# EAGLE design AGSE_BBB_cape (EAGLE 7.2.0)
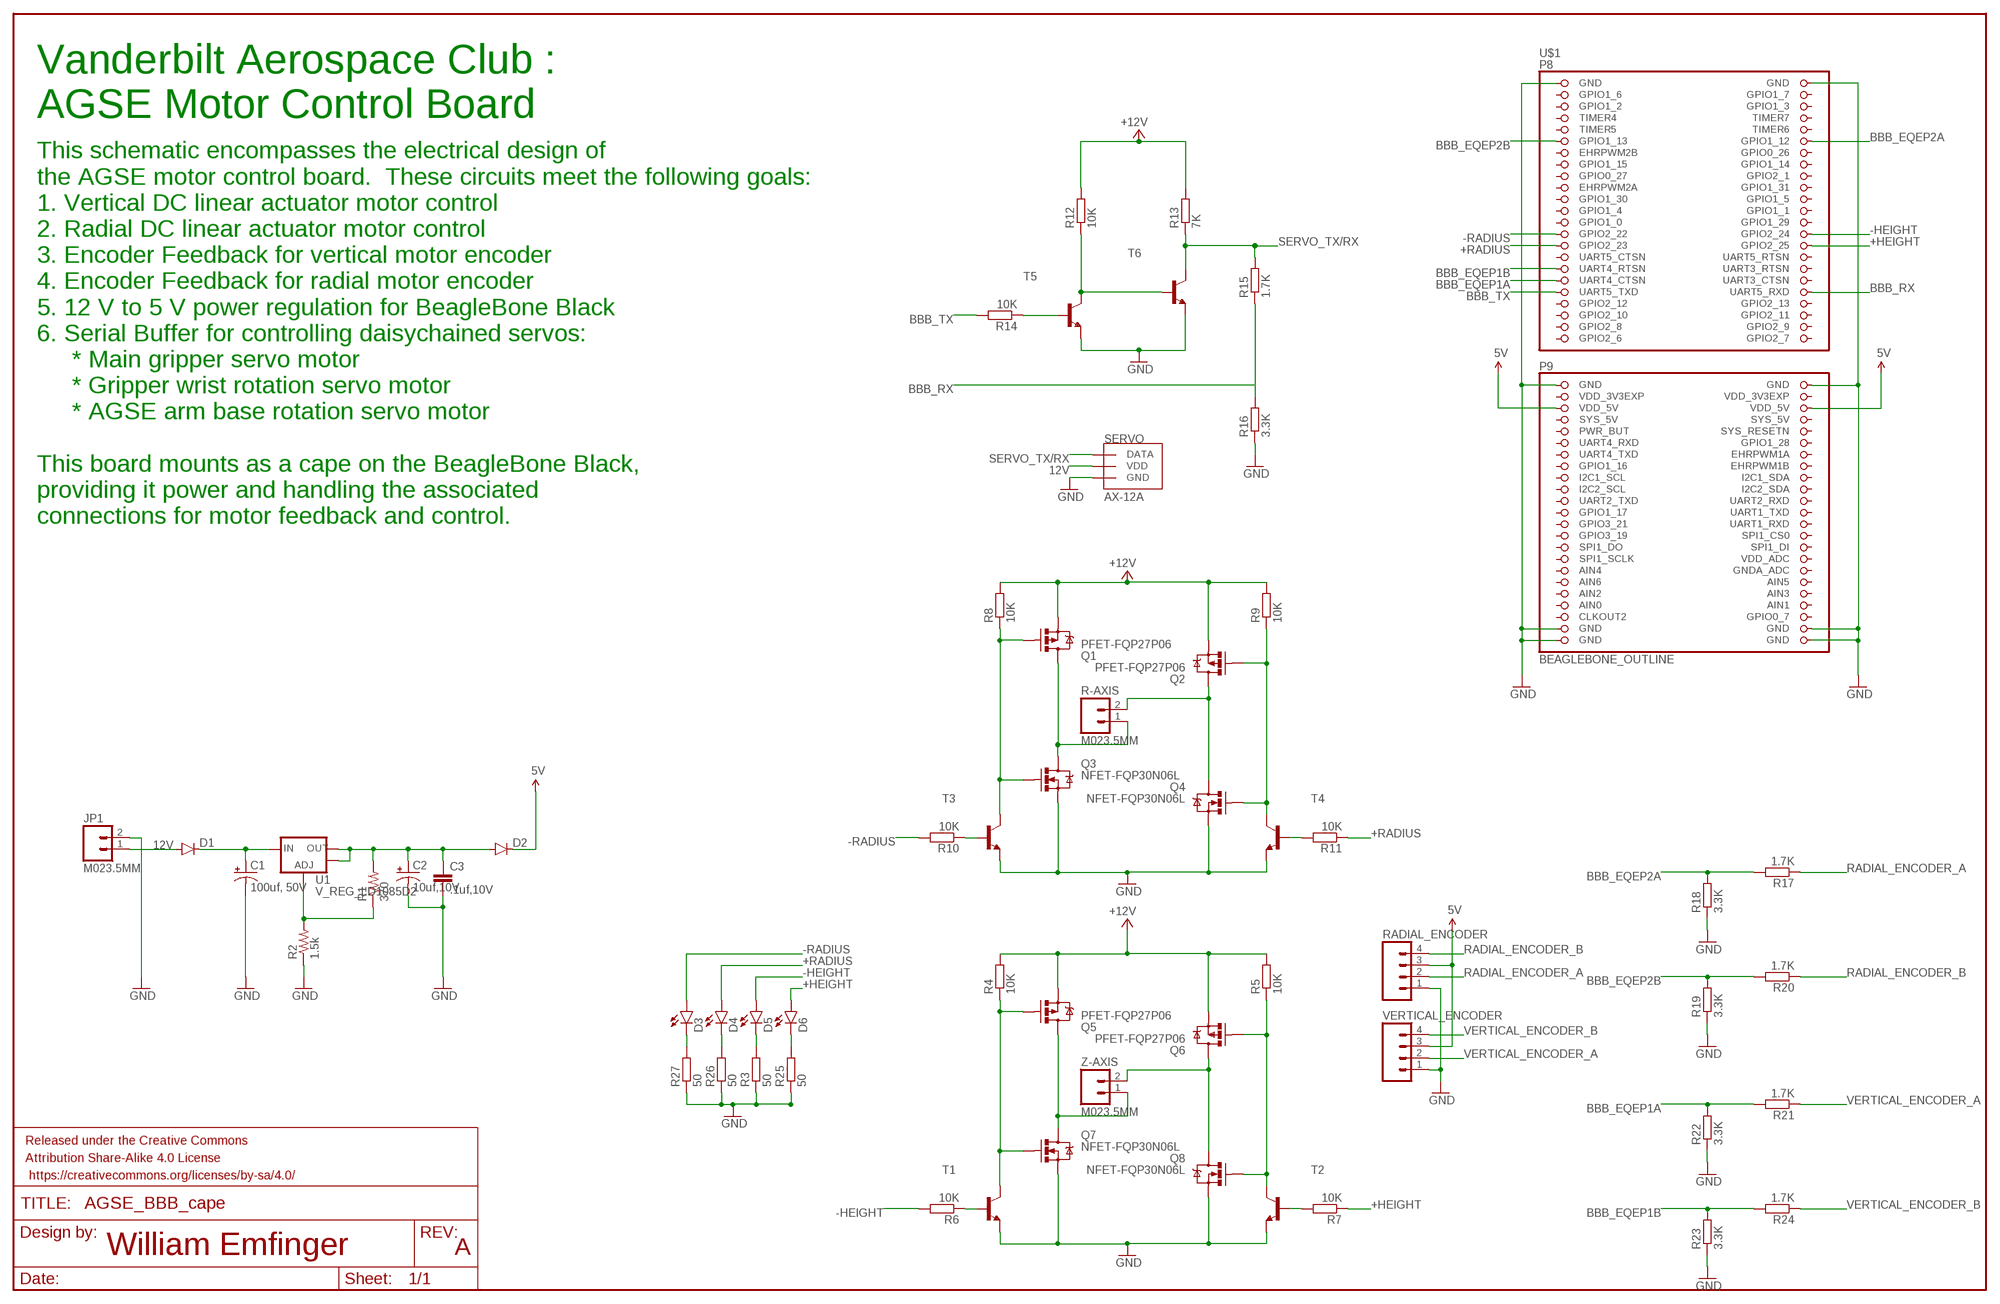
[diagram p0: schematic, sheet 1]

## Parts
C1  100uf, 50V  CAP_POLD  [PANASONIC_D]
C2  10uf,10V  CAP_POL1206  [EIA3216]
C3  .1uf,10V  CAP0402-CAP  [0402-CAP]
D1  DIODESMA  [SMA-DIODE]
D2  DIODE1N4148  [DIODE-1N4148]
D3  LED-FKIT-1206  [FKIT-LED-1206]
D4  LED-FKIT-1206  [FKIT-LED-1206]
D5  LED-FKIT-1206  [FKIT-LED-1206]
D6  LED-FKIT-1206  [FKIT-LED-1206]
FRAME1  FRAME-LEDGER  [CREATIVE_COMMONS]
JP1  M023.5MM  [SCREWTERMINAL-3.5MM-2]
Q1  PFET-FQP27P06  MOSFET-PCHANNELFQP27P06  [TO220V]
Q2  PFET-FQP27P06  MOSFET-PCHANNELFQP27P06  [TO220V]
Q3  NFET-FQP30N06L  MOSFET-NCHANNELFQP30N06L  [TO220V]
Q4  NFET-FQP30N06L  MOSFET-NCHANNELFQP30N06L  [TO220V]
Q5  PFET-FQP27P06  MOSFET-PCHANNELFQP27P06  [TO220V]
Q6  PFET-FQP27P06  MOSFET-PCHANNELFQP27P06  [TO220V]
Q7  NFET-FQP30N06L  MOSFET-NCHANNELFQP30N06L  [TO220V]
Q8  NFET-FQP30N06L  MOSFET-NCHANNELFQP30N06L  [TO220V]
R1  370  RESISTOR0402-RES  [0402-RES]
R2  1.5k  RESISTOR0402-RES  [0402-RES]
R3  50  R-EU_M0805  [M0805]
R4  10K  R-EU_M0805  [M0805]
R5  10K  R-EU_M0805  [M0805]
R6  10K  R-EU_M0805  [M0805]
R7  10K  R-EU_M0805  [M0805]
R8  10K  R-EU_M0805  [M0805]
R9  10K  R-EU_M0805  [M0805]
R10  10K  R-EU_M0805  [M0805]
R11  10K  R-EU_M0805  [M0805]
R12  10K  R-EU_M0805  [M0805]
R13  7K  R-EU_M0805  [M0805]
R14  10K  R-EU_M0805  [M0805]
R15  1.7K  R-EU_M0805  [M0805]
R16  3.3K  R-EU_M0805  [M0805]
R17  1.7K  R-EU_M0805  [M0805]
R18  3.3K  R-EU_M0805  [M0805]
R19  3.3K  R-EU_M0805  [M0805]
R20  1.7K  R-EU_M0805  [M0805]
R21  1.7K  R-EU_M0805  [M0805]
R22  3.3K  R-EU_M0805  [M0805]
R23  3.3K  R-EU_M0805  [M0805]
R24  1.7K  R-EU_M0805  [M0805]
R25  50  R-EU_M0805  [M0805]
R26  50  R-EU_M0805  [M0805]
R27  50  R-EU_M0805  [M0805]
R-AXIS  M023.5MM  [SCREWTERMINAL-3.5MM-2]
RADIAL_ENCODER  M04POLAR  [MOLEX-1X4]
SERVO  AX-12A  [SPOX-3]
T1  BF820-NPN-SOT23-BEC  [SOT23-BEC]
T2  BF820-NPN-SOT23-BEC  [SOT23-BEC]
T3  BF820-NPN-SOT23-BEC  [SOT23-BEC]
T4  BF820-NPN-SOT23-BEC  [SOT23-BEC]
T5  BF820-NPN-SOT23-BEC  [SOT23-BEC]
T6  BF820-NPN-SOT23-BEC  [SOT23-BEC]
U1  V_REG_LD1085D2  [D2PACK/A]
U$1  BEAGLEBONE_OUTLINE  [BEAGLEBONE_SHIELD]
VERTICAL_ENCODER  M04POLAR  [MOLEX-1X4]
Z-AXIS  M023.5MM  [SCREWTERMINAL-3.5MM-2]

## Nets
5V: D2.C RADIAL_ENCODER.3 U$1.51(VDD_5V) U$1.52(VDD_5V) VERTICAL_ENCODER.3
12V: D1.A JP1.1 Q1.3(S) Q2.3(S) Q5.3(S) Q6.3(S) R4.2 R5.2 R8.2 R9.2 R12.2 R13.2 SERVO.P$2(VDD) ; supply symbol labelled +12V
+HEIGHT: D6.A R7.1 U$1.30(GPIO2_25)
+RADIUS: D4.A R11.1 U$1.29(GPIO2_23)
-HEIGHT: D5.A R6.2 U$1.28(GPIO2_24)
-RADIUS: D3.A R10.2 U$1.27(GPIO2_22)
BBB_EQEP1A: R21.2 R22.2 U$1.35(UART4_CTSN)
BBB_EQEP1B: R23.2 R24.2 U$1.33(UART4_RTSN)
BBB_EQEP2A: R17.2 R18.2 U$1.12(GPIO1_12)
BBB_EQEP2B: R19.2 R20.2 U$1.11(GPIO1_13)
BBB_RX: R15.1 R16.2 U$1.38(UART5_RXD)
BBB_TX: R14.2 U$1.37(UART5_TXD)
GND: C1.- C2.C(-) C3.2 JP1.2 Q3.3(S) Q4.3(S) Q7.3(S) Q8.3(S) R2.1 R3.1 R16.1 R18.1 R19.1 R22.1 R23.1 R25.1 R26.1 R27.1 RADIAL_ENCODER.1 SERVO.P$3(GND) T1.E T2.E T3.E T4.E T5.E T6.E U$1.1(GND) U$1.2(GND) U$1.47(GND) U$1.48(GND) U$1.89(GND) U$1.90(GND) U$1.91(GND) U$1.92(GND) VERTICAL_ENCODER.1
N$1: D3.C R27.2
N$2: D4.C R26.2
N$3: C1.+ D1.C U1.3(IN)
N$4: R1.1 R2.2 U1.1(ADJ)
N$5: D5.C R3.2
N$6: D6.C R25.2
N$7: Q5.1(G) Q7.1(G) R4.1 T1.C
N$8: Q6.1(G) Q8.1(G) R5.1 T2.C
N$9: R6.1 T1.B
N$10: R7.2 T2.B
N$13: Q1.1(G) Q3.1(G) R8.1 T3.C
N$14: Q2.1(G) Q4.1(G) R9.1 T4.C
N$15: R10.1 T3.B
N$16: R11.2 T4.B
N$17: R14.1 T5.B
N$18: R12.1 T5.C T6.B
R+: Q1.2(D) Q3.2(D) R-AXIS.1
R-: Q2.2(D) Q4.2(D) R-AXIS.2
RADIAL_ENCODER_A: R17.1 RADIAL_ENCODER.2
RADIAL_ENCODER_B: R20.1 RADIAL_ENCODER.4
SERVO_TX/RX: R13.1 R15.2 SERVO.P$1(DATA) T6.C
VERTICAL_ENCODER_A: R21.1 VERTICAL_ENCODER.2
VERTICAL_ENCODER_B: R24.1 VERTICAL_ENCODER.4
VOUT: C2.A(+) C3.1 D2.A R1.2 U1.2(OUT) U1.TAB(OUT)
Z+: Q5.2(D) Q7.2(D) Z-AXIS.1
Z-: Q6.2(D) Q8.2(D) Z-AXIS.2
Unconnected: U$1.3(GPIO1_6) U$1.4(GPIO1_7) U$1.5(GPIO1_2) U$1.6(GPIO1_3) U$1.7(TIMER4) U$1.8(TIMER7) U$1.9(TIMER5) U$1.10(TIMER6) U$1.13(EHRPWM2B) U$1.14(GPIO0_26) U$1.15(GPIO1_15) U$1.16(GPIO1_14) U$1.17(GPIO0_27) U$1.18(GPIO2_1) U$1.19(EHRPWM2A) U$1.20(GPIO1_31) U$1.21(GPIO1_30) U$1.22(GPIO1_5) U$1.23(GPIO1_4) U$1.24(GPIO1_1) U$1.25(GPIO1_0) U$1.26(GPIO1_29) U$1.31(UART5_CTSN) U$1.32(UART5_RTSN) U$1.34(UART3_RTSN) U$1.36(UART3_CTSN) U$1.39(GPIO2_12) U$1.40(GPIO2_13) U$1.41(GPIO2_10) U$1.42(GPIO2_11) U$1.43(GPIO2_8) U$1.44(GPIO2_9) U$1.45(GPIO2_6) U$1.46(GPIO2_7) U$1.54(SYS_5V) U$1.55(PWR_BUT) U$1.56(SYS_RESETN) U$1.57(UART4_RXD) U$1.58(GPIO1_28) U$1.59(UART4_TXD) U$1.60(EHRPWM1A) U$1.61(GPIO1_16) U$1.62(EHRPWM1B) U$1.63(I2C1_SCL) U$1.64(I2C1_SDA) U$1.65(I2C2_SCL) U$1.66(I2C2_SDA) U$1.67(UART2_TXD) U$1.68(UART2_RXD) U$1.69(GPIO1_17) U$1.70(UART1_TXD) U$1.71(GPIO3_21) U$1.72(UART1_RXD) U$1.73(GPIO3_19) U$1.74(SPI1_CS0) U$1.75(SPI1_DO) U$1.76(SPI1_DI) U$1.77(SPI1_SCLK) U$1.78(VDD_ADC) U$1.79(AIN4) U$1.80(GNDA_ADC) U$1.81(AIN6) U$1.82(AIN5) U$1.83(AIN2) U$1.84(AIN3) U$1.86(AIN1) U$1.87(CLKOUT2) U$1.88(GPIO0_7)

## Notes on the sheet
- Vanderbilt Aerospace Club :
  AGSE Motor Control Board
- This schematic encompasses the electrical design of
  the AGSE motor control board.  These circuits meet the following goals:
  1. Vertical DC linear actuator motor control
  2. Radial DC linear actuator motor control
  3. Encoder Feedback for vertical motor encoder
  4. Encoder Feedback for radial motor encoder
  5. 12 V to 5 V power regulation for BeagleBone Black
  6. Serial Buffer for controlling daisychained servos:
       * Main gripper servo motor
       * Gripper wrist rotation servo motor
       * AGSE arm base rotation servo motor
  
  This board mounts as a cape on the BeagleBone Black, 
  providing it power and handling the associated
  connections for motor feedback and control.
- William Emfinger | A

## Power pins joined to a net without a drawn wire
AIN0: U$1.85(AIN0)
SYS_5V: U$1.53(SYS_5V)
VDD_3V3EXP: U$1.49(VDD_3V3EXP) U$1.50(VDD_3V3EXP)

## Library data of the parts
C1 = SparkFun-Passives:CAP_POL: Capacitor Polarized These are standard SMD and PTH capacitors. Normally 10uF, 47uF, and 100uF in electrolytic and tantalum varieties. Always verify the external diameter of the through hole cap, it varies with capacity, voltage, and manufacturer. The EIA devices should be standard.; MANEX: 123-0004264
C2 = SparkFun-Passives:CAP_POL: Capacitor Polarized These are standard SMD and PTH capacitors. Normally 10uF, 47uF, and 100uF in electrolytic and tantalum varieties. Always verify the external diameter of the through hole cap, it varies with capacity, voltage, and manufacturer. The EIA devices should be standard.; MANEX: 123-0001192
C3 = SparkFun-Passives:CAP: Capacitor Standard 0603 ceramic capacitor, and 0.1" leaded capacitor.; MANEX: 123-0001047
D1 = SparkFun-DiscreteSemi:DIODE: Diode These are standard reverse protection diodes and small signal diodes. SMA package can handle up to about 1A. SOD-323 can handle about 200mA. What the SOD-323 package when ordering, there are some mfgs out there that are 5-pin packages.; MANEX: 130-0001388
D2 = SparkFun-DiscreteSemi:DIODE: Diode These are standard reverse protection diodes and small signal diodes. SMA package can handle up to about 1A. SOD-323 can handle about 200mA. What the SOD-323 package when ordering, there are some mfgs out there that are 5-pin packages.; MANEX: 130-0002546
D3-D6 = SparkFun-LED:LED: LEDs Standard schematic elements and footprints for 5mm, 3mm, 1206, and 0603 sized LEDs. 5mm - Spark Fun Electronics SKU : COM-00529 (and others)
FRAME1 = SparkFun-Aesthetics:FRAME-LEDGER: Schematic Frame Standard 11x14 US Ledger frame
JP1 R-AXIS Z-AXIS = SparkFun-Connectors:M02: Standard 2-pin 0.1" header. Use with - straight break away headers ( PRT-00116) - right angle break away headers (PRT-00553) - swiss pins (PRT-00743) - machine pins (PRT-00117) - female headers (PRT-00115) Molex polarized connector foot print use with: PRT-08233 with associated crimp pins and housings. 2.54_SCREWTERM for use with PRT-10571. 3.5mm Screw Terminal footprints for PRT-08084 5mm Screw Terminal footprints for use with PRT-08432; MANEX: 257-0004040; PROD_ID: CONN-08399
Q1 Q2 Q5 Q6 = SparkFun-DiscreteSemi:MOSFET-PCHANNEL: Generic PMOSFET IRLML2244 - TRANS-11153 (SOT-23 -20V -4.3A) (1.Gate 2.Source 3.Drain) FQP27P06 - COM-10349 <http://www.sparkfun.com/products/10349> (TO-220 -60V -27A) (1.Gate 2.Source 3.Drain)
Q3 Q4 Q7 Q8 = SparkFun-DiscreteSemi:MOSFET-NCHANNEL: Common NMOSFET Parts MFG P/N Store ID Prod ID FDD8780 TRANS-09984 SI7820DN TRANS-11055 FDS6630A IC-08089 2N7002PW TRANS-11151 FQP30N06L COM-10213 TRANS-10060 BSS123LT1G TRANS-08345 BSS138 TRANS-00830 BS170 2N7000; PROD_ID: TRANS-10060
R1 = SparkFun-Passives:RESISTOR: Resistor Basic schematic elements and footprints for 0603, 1206, and PTH resistors.; MANEX: 110-0003316
R2 = SparkFun-Passives:RESISTOR: Resistor Basic schematic elements and footprints for 0603, 1206, and PTH resistors.; MANEX: 110-0001936
R3-R27 = resistor:R-EU_: RESISTOR, European symbol
RADIAL_ENCODER VERTICAL_ENCODER = SparkFun-Connectors:M04: Header 4 Standard 4-pin 0.1" header. Use with straight break away headers (SKU : PRT-00116), right angle break away headers (PRT-00553), swiss pins (PRT-00743), machine pins (PRT-00117), and female headers (PRT-00115). Molex polarized connector foot print use with SKU : PRT-08231 with associated crimp pins and housings. 1MM SMD Version SKU: PRT-10208
SERVO = molex-spox:AX-12A: Dynamixel AX-12A female connection package. This part uses the molex spox 2.5mm 3-pin connector part number: 22-43-6030 datasheet: http://www.molex.com/pdm_docs/sd/022436030_sd.pdf
T1-T6 = transistor:*-NPN-: NPN Transistror BF959 corrected 2008.03.06
U1 = SparkFun-PowerIC:V_REG_LD1085: LD1085 3A low-drop positive voltage regulator, adjustable The LD1085xx is a low drop voltage regulator able to provide up to 3 A of output current. Dropout is guaranteed at a maximum of 1.2 V at the maximum output current, decreasing at lower loads. The LD1085xx is pin to pin compatible with the older 3-terminal adjustable regulators, but has better performances in term of drop and output tolerance. Available Packages D2PAK/A - 3-pin w/ tabs, SMD; MANEX: 140-0004281
U$1 = adafruit:BEAGLEBONE_OUTLINE: Should match A3 pinout - but not completely tested

## Net classes
0 default: width 0.152 mm, drill 0.305 mm, clearance 0.152 mm

## Board
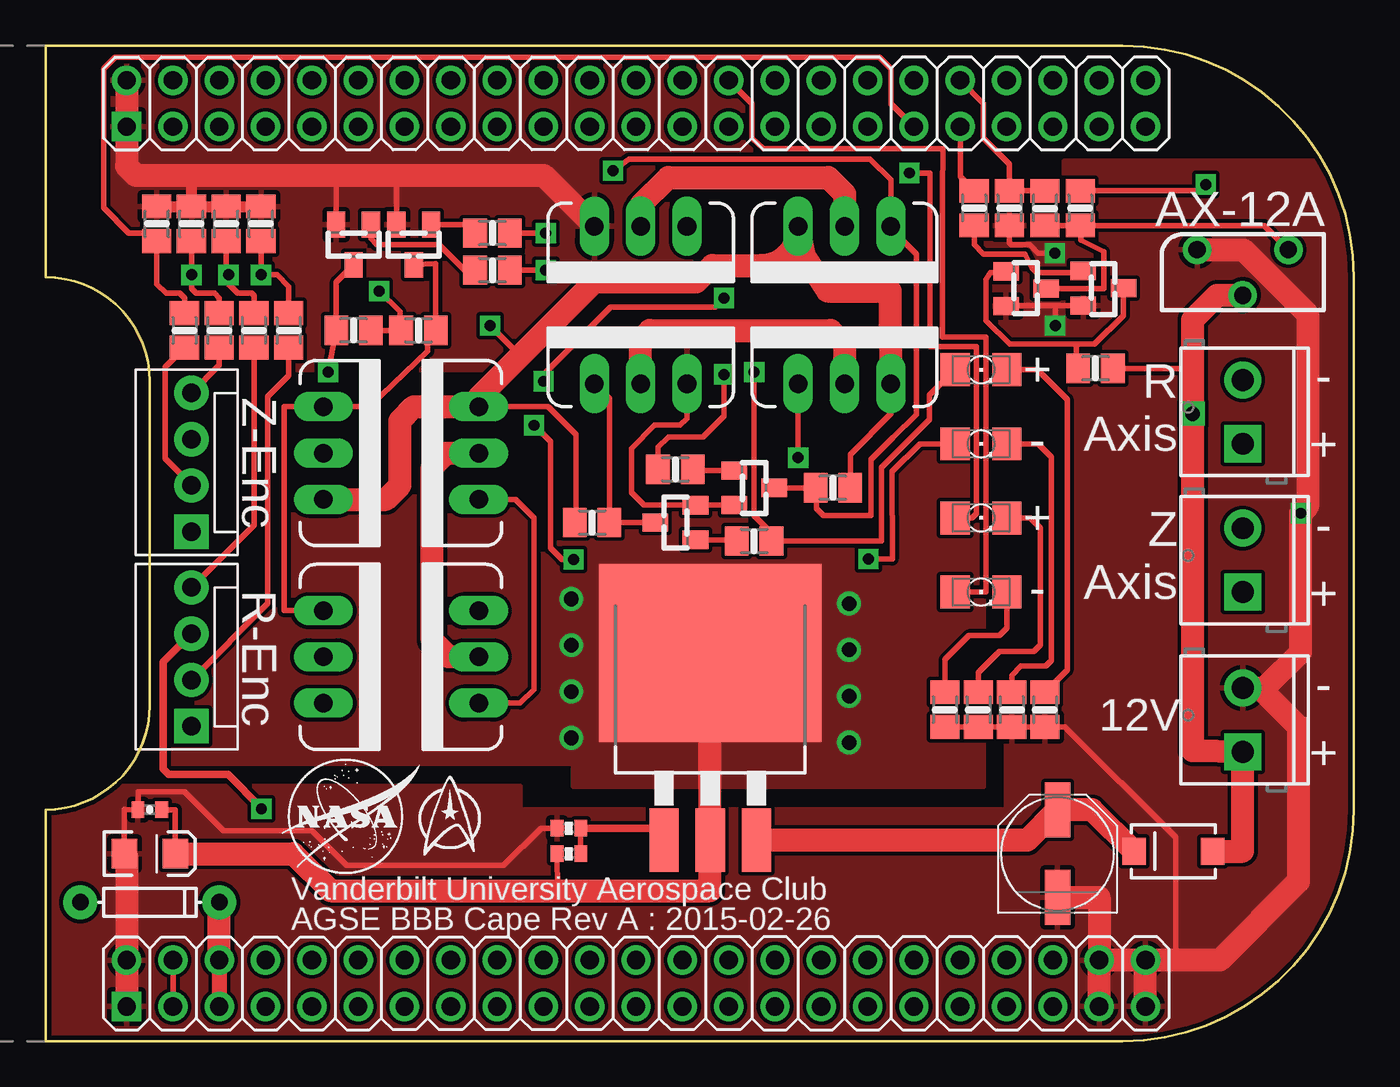
[diagram p1: board, top side]
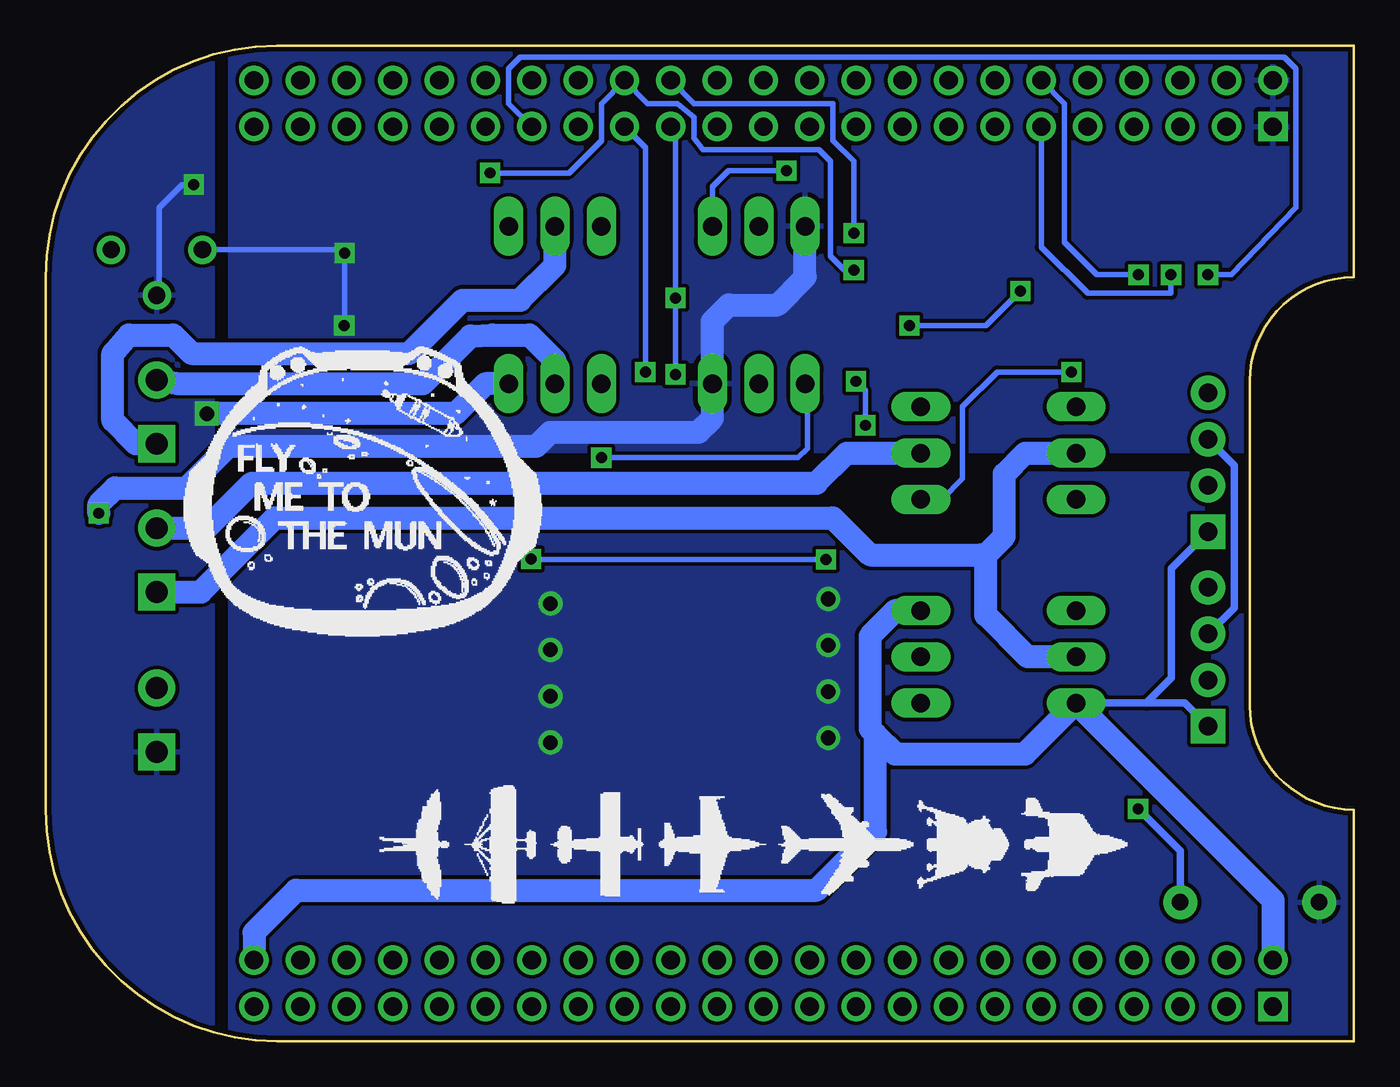
[diagram p2: board, bottom side, seen from below]

Size 71.75 x 54.61 mm. Coordinates in mm from the lower left corner, seen from the top.
Copper layers (1*16): Top 0.035mm / dielectric 1.5mm / Bottom 0.035mm
Design rules "SparkFun": minimum track width 8mil, minimum drill 20mil, track to track 8mil, track to pad 8mil, pad to pad 8mil, via to via 8mil, smd to smd 8mil, copper to edge 10mil, drill to drill 8mil, minimum pad ring 12mil, minimum via ring 10mil, stop-mask expansion 4mil, vias tented up to drill 25mil, thermal gap 10mil

### Footprints (pad centres in the part's own frame; a part is rotated, then mirrored left to right if it is on the bottom)
PANASONIC_D = smd 3 x 1.4: + 2.4,0; - -2.4,0
EIA3216 = smd 1.4 x 1.6: A 1.4,0; C -1.4,0
0402-CAP = smd 0.7 x 0.9: 1 -0.65,0; 2 0.65,0
SMA-DIODE = smd 1.27 x 1.47: A -2.15,0; C 2.15,0
DIODE-1N4148 = drill 0.9 pad 1.88: A -3.81,0; C 3.81,0
FKIT-LED-1206 = smd 1.6 x 1.803: A -1.422,0; C 1.422,0
SCREWTERMINAL-3.5MM-2 = drill 1.2 pad 2.032 square: 1 0,0 | drill 1.2 pad 2.032: 2 3.5,0
TO220V = drill 1.016 long: 1 -2.54,0; 2 0,0; 3 2.54,0
0402-RES = smd 0.7 x 0.9: 1 -0.65,0; 2 0.65,0
M0805 = smd 1.3 x 1.6: 1 -0.95,0; 2 0.95,0
MOLEX-1X4 = drill 1.016 pad 1.88 square: 1 0,0 | drill 1.016 pad 1.88: 2 2.54,0; 3 5.08,0; 4 7.62,0
SPOX-3 = drill 0.95: P$1 2.5,1.25; P$2 0,-1.25; P$3 -2.5,1.25
SOT23-BEC = smd 1 x 1.4: B -0.95,-1.1; C 0,1.1; E 0.95,-1.1
D2PACK/A = smd 1.6 x 3.5: 1 -2.54,-8.275; 2 0,-8.275; 3 2.54,-8.275 | smd 12.2 x 9.75: TAB 0,2
BEAGLEBONE_SHIELD = drill 1 square: 1 4.445,19.05; 47 52.705,19.05 | drill 1: 2 1.905,19.05; 3 4.445,21.59; 4 1.905,21.59; 5 4.445,24.13; 6 1.905,24.13; 7 4.445,26.67; 8 1.905,26.67; 9 4.445,29.21; 10 1.905,29.21; 11 4.445,31.75; 12 1.905,31.75; 13 4.445,34.29; 14 1.905,34.29; 15 4.445,36.83; 16 1.905,36.83; 17 4.445,39.37; 18 1.905,39.37; 19 4.445,41.91; 20 1.905,41.91; 21 4.445,44.45; 22 1.905,44.45; 23 4.445,46.99; 24 1.905,46.99; 25 4.445,49.53; 26 1.905,49.53; 27 4.445,52.07; 28 1.905,52.07; 29 4.445,54.61; 30 1.905,54.61; 31 4.445,57.15; 32 1.905,57.15; 33 4.445,59.69; 34 1.905,59.69; 35 4.445,62.23; 36 1.905,62.23; 37 4.445,64.77; 38 1.905,64.77; 39 4.445,67.31; 40 1.905,67.31; 41 4.445,69.85; 42 1.905,69.85; 43 4.445,72.39; 44 1.905,72.39; 45 4.445,74.93; 46 1.905,74.93; 48 50.165,19.05; 49 52.705,21.59; 50 50.165,21.59; 51 52.705,24.13; 52 50.165,24.13; 53 52.705,26.67; 54 50.165,26.67; 55 52.705,29.21; 56 50.165,29.21; 57 52.705,31.75; 58 50.165,31.75; 59 52.705,34.29; 60 50.165,34.29; 61 52.705,36.83; 62 50.165,36.83; 63 52.705,39.37; 64 50.165,39.37; 65 52.705,41.91; 66 50.165,41.91; 67 52.705,44.45; 68 50.165,44.45; 69 52.705,46.99; 70 50.165,46.99; 71 52.705,49.53; 72 50.165,49.53; 73 52.705,52.07; 74 50.165,52.07; 75 52.705,54.61; 76 50.165,54.61; 77 52.705,57.15; 78 50.165,57.15; 79 52.705,59.69; 80 50.165,59.69; 81 52.705,62.23; 82 50.165,62.23; 83 52.705,64.77; 84 50.165,64.77; 85 52.705,67.31; 86 50.165,67.31; 87 52.705,69.85; 88 50.165,69.85; 89 52.705,72.39; 90 50.165,72.39; 91 52.705,74.93; 92 50.165,74.93

### Placement (x,y rotation side)
C1  55.5,10.29 90 top
C2  5.71,10.29 0 top
C3  5.71,12.7 180 top
D1  61.85,10.41 180 top
D2  5.71,7.62 0 top
D3  51.31,32.77 0 top
D4  51.31,36.83 0 top
D5  51.31,24.64 0 top
D6  51.31,28.7 0 top
DRILEGEND  [DRILEGEND]  -4.06,-0.25 0 top  (outside the outline)
FRAME1  -4.06,-0.25 90 top  (outside the outline)
JP1  65.66,15.88 90 top
Q1  43.81,44.7 180 top
Q2  43.81,36.07 0 top
Q3  32.64,44.7 180 top
Q4  32.64,36.07 0 top
Q5  15.24,32.26 270 top
Q6  23.75,32.26 90 top
Q7  15.24,21.08 270 top
Q8  23.75,21.08 90 top
R1  28.7,10.29 180 top
R2  28.7,11.68 0 top
R3  49.33,18.19 90 top
R4  20.45,38.99 180 top
R5  16.89,38.99 0 top
R6  24.51,44.32 0 top
R7  24.51,42.29 180 top
R8  43.18,30.35 0 top
R9  29.97,28.45 180 top
R10  34.54,31.37 180 top
R11  38.86,27.43 180 top
R12  57.58,36.91 0 top
R13  56.74,45.69 90 top
R14  50.93,45.69 90 top
R15  54.81,45.69 270 top
R16  52.86,45.69 90 top
R17  13.34,38.99 90 top
R18  11.81,44.83 270 top
R19  9.91,44.83 270 top
R20  11.43,38.99 90 top
R21  7.62,38.99 90 top
R22  6.1,44.83 270 top
R23  8,44.83 270 top
R24  9.53,38.99 90 top
R25  51.16,18.19 90 top
R26  54.81,18.19 90 top
R27  52.98,18.19 90 top
R-AXIS  65.66,32.77 90 top
RADIAL_ENCODER  8,17.27 90 top
SERVO  65.66,42.16 0 top
T1  20.19,43.69 180 top
T2  16.89,43.69 180 top
T3  38.86,30.35 270 top
T4  34.54,28.45 90 top
T5  58.01,41.3 270 top
T6  53.77,41.28 270 top
U1  36.45,19.3 0 top
U$1  -14.61,54.61 270 top
VERTICAL_ENCODER  8,27.94 90 top
Z-AXIS  65.66,24.64 90 top

### Tracks (layer width: path | path; a pad name or v marks a point on that pad's centre or on a via)
5V  (via drill 0.6)
  Top 0.406: RADIAL_ENCODER.3 6.45,20.8 6.45,14.94 6.76,14.63 10.01,14.63 11.84,12.8 v11.84,12.75
  Top 0.813: U$1.52 U$1.51
  Top 1.27: U$1.52 D2.C
  Bottom 0.406: VERTICAL_ENCODER.3 6.55,31.57 6.55,23.77 7.98,22.35 RADIAL_ENCODER.3 | v11.84,12.75 9.53,10.44 D2.C
12V  (via drill 0.6, 0.8)
  Top 0.305: R5.2 R4.2 19.43,39.05 19.43,40.01 v18.29,41.15 | v24.38,39.24 25.65,37.97 26.42,37.97 | Q6.3 27.56,34.8 29.08,33.27 29.08,28.51 R9.2 | R8.2 44.13,32.19 46.35,34.42 Q2.3 | R13.2 63.28,46.65 v63.63,46.99 | R12.2 62.92,36.91 62.92,37.08
  Top 1.27: Q2.3 46.35,37.08 46.33,41.15 42.88,41.15 41.63,43.05 Q1.3 arc-93 39.24,42.55 36.58,42.55 35.69,41.66 30.1,41.66 26.42,37.97 23.75,35.31 Q6.3 20.19,34.8 19.43,34.04 19.43,30.48 18.67,29.72 Q5.3 | D1.A 65.66,10.41 JP1.1 62.92,15.93 v62.92,34.42 62.92,37.08 62.92,39.57 64.26,40.91 SERVO.P$2
  Bottom 0.305: v18.29,41.15 20.19,39.24 v24.38,39.24 | v63.63,46.99 64.26,46.99 65.53,45.72 65.53,41.04 SERVO.P$2
  Bottom 1.27: Q2.3 47.62,36.07 49.28,34.42 v62.92,34.42
  pour Bottom: 62.61,54.61 62.61,0 71.75,0 71.75,54.61
+HEIGHT  (via drill 0.6)
  Top 0.305: R7.1 v27.43,42.29 | v47.37,47.62 48.51,47.62 48.51,38.1 51.05,38.1 51.05,28.96 50.8,28.7 D6.A
  Bottom 0.305: v27.43,42.29 27.94,42.29 28.7,43.05 28.7,48.26 29.34,48.9 35.69,48.9 36.2,49.53 36.2,50.67 37.08,51.44 38.73,51.44 U$1.30 41.27,51.44 41.27,49.4 43.05,47.62 v47.37,47.62
+RADIUS  (via drill 0.6)
  Top 0.305: v38.86,36.7 38.86,28.83 39.81,27.88 R11.1 45.85,27.43 45.85,31.47 48.46,34.09 48.46,35.43 D4.A
  Bottom 0.305: v38.86,36.7 38.86,49.02 U$1.29
-HEIGHT  (via drill 0.6)
  Top 0.305: R6.2 v27.43,44.32 | U$1.28 38.73,51.44 38.73,49.53 39.37,48.95 49.23,48.95 49.2,46.53 49.2,38.61 51.56,38.61 51.56,24.64 D5.A
  Bottom 0.305: v27.43,44.32 27.43,48.26 28.58,49.4 28.58,51.44 36.2,51.44 U$1.28
-RADIUS  (via drill 0.6)
  Top 0.305: R10.2 33.59,32.58 34.16,33.15 36.07,33.15 37.21,34.29 v37.21,36.58 | D3.A 47.95,32.77 46.43,31.24 46.43,26.44 v45.14,26.44 | v28.96,26.42 28.32,26.42 27.69,27.05 27.69,32.89 v26.8,33.78 | v27.3,36.2 27.3,36.58 30.99,40.26 36.7,40.26 v37.21,40.77
  Bottom 0.305: v37.21,36.58 v37.21,40.77 37.21,49.91 U$1.27 | v26.8,33.78 26.8,35.69 v27.3,36.2 | v28.96,26.42 45.11,26.42 v45.14,26.44
BBB_EQEP1A
  Top 0.305: U$1.35 46.35,51.44 46.35,53.34 45.72,53.98 3.81,53.98 3.17,53.34 3.17,45.72 4.57,44.32 6.04,44.32 R22.2 6.1,41.53 6.6,41.02 7.37,41.02 7.62,40.77 R21.2
BBB_EQEP1B  (via drill 0.6)
  Top 0.305: R23.2 v8,42.04 8,41.28 8.26,41.02 9.27,41.02 9.53,40.77 R24.2
  Bottom 0.305: U$1.33 46.35,51.44 46.35,53.34 45.72,53.98 3.81,53.98 3.17,53.34 3.17,45.72 6.73,42.04 v8,42.04
BBB_EQEP2A  (via drill 0.6)
  Top 0.305: R18.2 v11.81,42.04 12.7,42.04 13.34,41.4 R17.2
  Bottom 0.305: U$1.12 15.88,51.44 15.88,43.82 14.1,42.04 v11.81,42.04
BBB_EQEP2B  (via drill 0.6)
  Top 0.305: R19.2 9.91,42.16 v10.03,42.04 10.03,41.53 10.54,41.02 11.3,41.02 11.43,40.89 R20.2
  Bottom 0.305: U$1.11 17.14,43.56 14.61,41.02 10.03,41.02 v10.03,42.04
BBB_RX
  Top 0.305: U$1.38 51.44,51.44 51.44,49.53 52.86,48.11 R16.2 R15.1
BBB_TX
  Top 0.305: U$1.37 50.16,47.41 R14.2
GND  (via drill 0.6)
  Top 0.305: T3.E T4.E | T4.E | T2.E 15.94,47.44 15.37,47.5 | T1.E 19.24,47.31 19.43,47.5 | T4.E 32.83,29.4 32.13,30.1 32.13,32.51 33.4,33.78 34.8,33.78 35.18,34.16 Q4.3 | C2.C 4.31,12.71 C3.2 5.08,12.72 5.08,13.67 7.62,13.67 9.75,11.53 14.63,11.53 16.51,9.65 25.13,9.65 27.16,11.68 R2.1 | 14.86,47.37 14.73,47.5 | T6.E 52.82,40.35 55.37,40.35 | 55.37,40.35 T5.E | v55.37,39.24 55.37,40.35 | R16.1 52.86,43.79 52.96,43.69 53.98,43.69 54.43,43.23 v55.35,43.23 | 61.98,4.45 61.98,11.18 55.92,17.24 R26.1 R27.1 R25.1 R3.1
  Top 0.61: R22.1 R23.1 | R23.1 R19.1 R18.1 | R23.1 8,47.5
  Top 1.27: C1.- 57.78,7.89 U$1.90 | U$1.2 U$1.1 4.45,48.01 4.95,47.5 8,47.5 14.73,47.5 15.37,47.5 19.43,47.5 27.3,47.5 Q3.3 | C2.C 4.45,10.16 U$1.48 U$1.47 | U$1.91 U$1.92 | U$1.89 U$1.90 | U$1.92 U$1.90 | U$1.92 61.98,4.45 64.39,4.45 68.71,8.76 68.71,17.27 66.6,19.38 JP1.2 66.87,19.38 68.83,21.34 v68.83,28.96 69.22,29.34 69.22,39.88 65.68,43.41 SERVO.P$3
  Bottom 0.305: v55.37,39.24 55.35,39.24 v55.35,43.23 55.35,43.41 SERVO.P$3
  Bottom 0.406: VERTICAL_ENCODER.1 10.01,25.93 10.01,19.91 11.38,18.54 | 11.38,18.54 Q7.3 | RADIAL_ENCODER.1 9.27,18.54 11.38,18.54
  Bottom 1.27: Q3.3 30.1,41.91 31.62,40.39 34.29,40.39 35.18,39.5 Q4.3 35.18,34.16 35.94,33.4 44.07,33.4 44.83,32.64 61.72,32.64 64.01,30.35 67.94,30.35 68.83,29.46 v68.83,28.96 | U$1.48 4.45,7.75 Q7.3 18.03,15.75 25.15,15.75 26.24,16.84 | Q8.3 25.15,23.62 26.54,22.23 26.54,17.15 26.24,16.84 | U$1.92 60.32,5.97 58.01,8.28 29.46,8.28 26.24,11.51 26.24,16.84
  pour Top: -0.64,0 -0.64,13.97 26.04,13.97 26.04,12.7 52.7,12.7 52.7,19.05 71.75,19.05 71.75,0
  pour Top: 55.88,48.26 55.88,12.7 71.75,12.7 71.75,48.26
  pour Top: -0.64,54.61 -0.64,36.83 69.22,36.83 69.22,54.61
  pour Bottom: -0.64,54.61 -0.64,32.39 61.6,32.39 61.6,54.61
N$1
  Top 0.305: D3.C 54.46,32.77 55.17,32.05 55.17,20.88 54.86,20.57 53.49,20.57 52.98,20.07 R27.2
N$2
  Top 0.305: D4.C 54.41,36.83 56.03,35.2 56.03,20.36 R26.2
N$3
  Top 1.27: D1.C 57.4,12.7 C1.+ 53.84,11.03 U1.3
N$4
  Top 0.305: R1.1 R2.2
  Top 0.406: R2.2 33.91,11.68 U1.1
N$5
  Top 0.305: D5.C 52.73,22.66 52.32,22.25 50.65,22.25 49.33,20.93 R3.2
N$6
  Top 0.305: D6.C 54,28.7 54.56,28.14 54.56,21.74 54.2,21.39 52.32,21.39 51.16,20.22 R25.2
N$7
  Top 0.305: Q7.1 13.08,23.62 13.08,34.8 Q5.1 17.78,34.8 20.95,37.85 20.95,38.55 R4.1 21.4,42.65 T1.C
N$8  (via drill 0.6)
  Top 0.305: Q6.1 25.78,29.72 26.8,28.7 26.8,19.3 26.04,18.54 Q8.1 | v15.49,36.7 R5.1 15.94,41.64 T2.C
  Bottom 0.305: Q6.1 22.61,29.72 21.46,30.86 21.46,34.8 19.56,36.7 v15.49,36.7
N$9
  Top 0.305: T1.B 23.1,44.79 R6.1
N$10
  Top 0.305: R7.2 22.99,42.29 21.59,43.69 18.16,43.69 17.84,44.01 T2.B
N$13  (via drill 0.6)
  Top 0.305: T3.C R8.1 42.29,30.29 42.29,29.21 42.67,28.83 45.26,28.83 45.26,31.9 46.48,33.12 47.75,34.37 47.75,43.18 46.35,44.58 Q1.1 46.35,47.24 45.21,48.39 32,48.39 v31.12,47.75
  Bottom 0.305: v31.12,47.75 34.29,47.75 35.18,46.86 Q3.1
N$14  (via drill 0.6)
  Top 0.305: Q4.1 30.92,35.25 R9.1 T4.C | Q2.1 v41.27,32
  Bottom 0.305: v41.27,32 30.48,32 29.97,32.51 29.97,35.94 Q4.1
N$15
  Top 0.305: T3.B 35.56,31.3 R10.1
N$16
  Top 0.305: T4.B 37.85,27.5 R11.2
N$17
  Top 0.305: R14.1 50.93,43.69 51.44,43.18 53.72,43.18 54.1,42.42 54.36,42.16 56.83,42.16 T5.B
N$18
  Top 0.305: T5.C 59.11,39.81 57.53,38.23 56.54,38.23 | 56.54,38.23 52.88,38.23 51.56,39.52 51.56,41.78 51.82,42.16 52.74,42.16 T6.B | R12.1 56.54,36.91 56.54,38.23
R+
  Top 1.27: Q3.2 32.64,45.85 34.16,47.37 42.93,47.37 43.81,46.48 Q1.2
  Bottom 1.27: R-AXIS.1 66.8,32.77 68.07,34.04 68.07,37.72 67.18,38.73 64.77,38.73 63.75,37.72 51.82,37.72 48.9,40.64 45.72,40.64 43.81,42.55 Q1.2
R-
  Top 1.27: Q4.2 32.64,38.48 33.15,38.99 43.05,38.99 43.81,38.23 Q2.2
  Bottom 1.27: R-AXIS.2 64.44,36.07 51.05,36.07 48.46,38.68 47.24,38.73 45.21,38.73 43.81,37.34 Q2.2
RADIAL_ENCODER_A
  Top 0.305: R17.1 13.34,36.5 12.19,35.36 12.19,24 RADIAL_ENCODER.2
RADIAL_ENCODER_B
  Top 0.305: R20.1 11.43,28.32 RADIAL_ENCODER.4
SERVO_TX/RX
  Top 0.305: T6.C 58.04,41.28 58.04,43.31 56.77,43.94 56.77,44.72 R13.1 | R15.2 R13.1 | SERVO.P$1 66.83,44.75 R13.1
VDD_3V3EXP
  Top 0.305: U$1.50 U$1.49
VERTICAL_ENCODER_A
  Top 0.305: R21.1 6.55,36.97 6.55,31.95 8,30.51 VERTICAL_ENCODER.2
VERTICAL_ENCODER_B
  Top 0.305: R24.1 9.53,37.08 VERTICAL_ENCODER.4
VOUT  (via drill 0.8)
  Top 0.305: R1.2 28.07,8.26 | C3.1 7.11,12.7 7.11,10.41
  Top 1.27: U1.TAB U1.2 36.45,8.26 28.07,8.26 15.62,8.26 13.59,10.29 C2.A 7.11,10.41
  other vias: 44.07,16.38 44.07,18.92 44.07,21.46 44.07,24 28.83,24.26 28.83,21.72 28.83,19.18 28.83,16.64
  pour Top (no thermals): 0.63,35.56 0.63,15.24 28.96,15.24 28.96,13.97 51.44,13.97 51.44,35.56
  pour Bottom: -0.64,31.12 -0.64,0 61.6,0 61.6,31.12
Z+
  Bottom 1.27: Z-AXIS.1 63.25,24.64 59.18,28.7 28.58,28.7 26.54,26.67 20.45,26.67 | 20.45,26.67 20.19,26.67 19.18,27.69 19.18,31.12 18.03,32.26 Q5.2 | Q7.2 17.91,21.08 20.19,23.37 20.19,26.42 20.45,26.67
Z-
  Top 1.27: Q8.2 22.1,21.08 21.21,21.97 21.21,31.5 21.97,32.26 Q6.2
  Bottom 1.27: Z-AXIS.2 62.92,28.14 60.45,30.61 29.46,30.61 27.81,32.26 Q6.2

### Text on the board
tPlace: AX-12A | + | - | R / Axis | Z-Enc | - | + | + | - | Z / Axis | - | + | R-Enc | - | 12V | + | Vanderbilt University Aerospace Club | AGSE BBB Cape Rev A : 2015-02-26